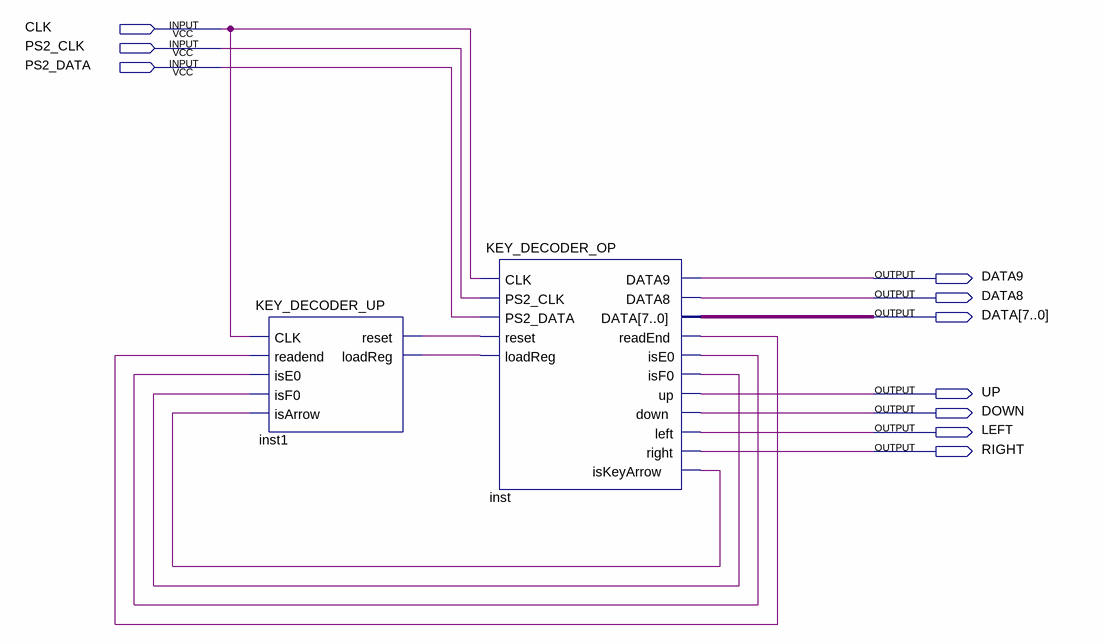
[diagram p0: schematic sheet]
// Quartus schematic KEY_DECODER.bdf as structural Verilog: 2 symbols, 10 pins
module KEY_DECODER (
  input  CLK,
  input  PS2_CLK,
  input  PS2_DATA,
  output DATA9,
  output DATA8,
  output [7:0] DATA,
  output UP,
  output DOWN,
  output LEFT,
  output RIGHT
);

  wire inst1_loadreg, inst1_reset, inst_ise0, inst_isf0, inst_iskeyarrow, inst_readend;

  KEY_DECODER_UP inst1 (
    .CLK(CLK), .readend(inst_readend), .isE0(inst_ise0), .isF0(inst_isf0), .isArrow(inst_iskeyarrow),
    .reset(inst1_reset), .loadReg(inst1_loadreg));
  KEY_DECODER_OP inst (
    .CLK(CLK), .PS2_CLK(PS2_CLK), .PS2_DATA(PS2_DATA), .reset(inst1_reset), .loadReg(inst1_loadreg),
    .DATA9(DATA9), .DATA8(DATA8), .DATA(DATA), .readEnd(inst_readend), .isE0(inst_ise0), .isF0(inst_isf0),
    .up(UP), .down(DOWN), .left(LEFT), .right(RIGHT), .isKeyArrow(inst_iskeyarrow));
endmodule
